# Altium project picr22-valdis.PrjPcb
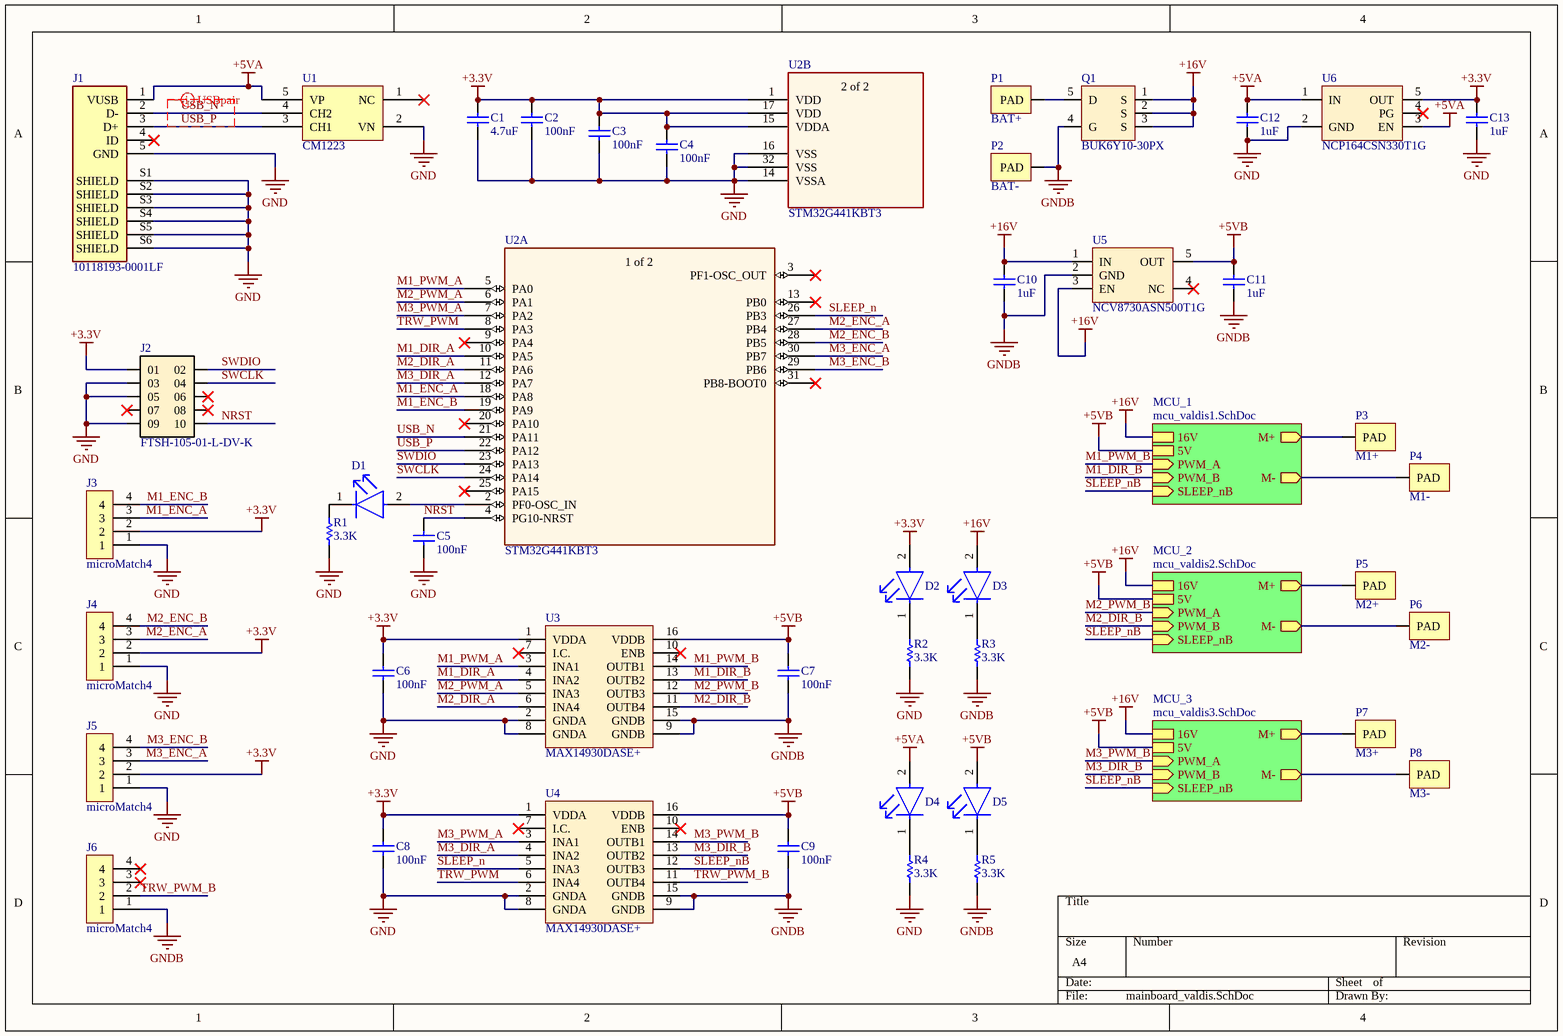
[diagram p0: mainboard_valdis.SchDoc]
4 sheets, 86 parts. Net scope: hierarchical (ports join the sheet entries above them; power ports are global).
Board file: PCB1.PcbDoc
Sheets:
  mainboard_valdis.SchDoc
    MCU_1 = mcu_valdis1.SchDoc
    MCU_2 = mcu_valdis2.SchDoc
    MCU_3 = mcu_valdis3.SchDoc

## Sheet mainboard_valdis.SchDoc
size A4; SheetNumber: 1; SheetTotal: 4

### Parts
C1  4.7uF  [CAPC1608X90X35ML10T15]
C2  100nF  [CAPC1608X90X35ML10T15]
C3  100nF  [CAPC1608X90X35ML10T15]
C4  100nF  [CAPC1608X90X35ML10T15]
C5  100nF  [CAPC1608X90X35ML10T15]
C6  100nF  [CAPC1608X90X35ML10T15]
C7  100nF  [CAPC1608X90X35ML10T15]
C8  100nF  [CAPC1608X90X35ML10T15]
C9  100nF  [CAPC1608X90X35ML10T15]
C10  1uF  [CAPC1608X90X35ML10T15]
C11  1uF  [CAPC1608X90X35ML10T15]
C12  1uF  [CAPC1608X90X35ML10T15]
C13  1uF  [CAPC1608X90X35ML10T15]
D1  LTST-C191TBKT  [FP-LTST-C191TBKT-MFG]  (value not drawn)
D2  LTST-C191TBKT  [FP-LTST-C191TBKT-MFG]  (value not drawn)
D3  LTST-C191TBKT  [FP-LTST-C191TBKT-MFG]  (value not drawn)
D4  LTST-C191TBKT  [FP-LTST-C191TBKT-MFG]  (value not drawn)
D5  LTST-C191TBKT  [FP-LTST-C191TBKT-MFG]  (value not drawn)
J1  10118193-0001LF  [FCI_10118193-0001LF]
J2  FTSH-105-01-L-DV-K  [FTSH-105-01-XXX-DV-K]
J3  microMatch4  [microMatch4]
J4  microMatch4  [microMatch4]
J5  microMatch4  [microMatch4]
J6  microMatch4  [microMatch4]
P1  BAT+  [PCBComponent_1]
P2  BAT-  [PCBComponent_1]
P3  M1+  [PCBComponent_1]
P4  M1-  [PCBComponent_1]
P5  M2+  [PCBComponent_1]
P6  M2-  [PCBComponent_1]
P7  M3+  [PCBComponent_1]
P8  M3-  [PCBComponent_1]
Q1  BUK6Y10-30PX  [TO127P600X120-5N]
R1  3.3K  [RESC1609X50X30NL8T20]
R2  3.3K  [RESC1609X50X30NL8T20]
R3  3.3K  [RESC1609X50X30NL8T20]
R4  3.3K  [RESC1609X50X30NL8T20]
R5  3.3K  [RESC1609X50X30NL8T20]
U1  CM1223  [SOT23-5]
U2  STM32G441KBT3  [LQFP32_7X7_STM]  (parts A,B of 2)
U3  MAX14930DASE+  [21-0041_S16+1_MXM]
U4  MAX14930DASE+  [21-0041_S16+1_MXM]
U5  NCV8730ASN500T1G  [TSSOP5]
U6  NCP164CSN330T1G  [SOP95P275X110-5N]

### Sub-sheets
MCU_1 = mcu_valdis1.SchDoc: 16V, 5V, PWM_A (in), M+ (out), M- (out), PWM_B (in), SLEEP_nB (in)
MCU_2 = mcu_valdis2.SchDoc: 16V, 5V, PWM_A (in), M+ (out), M- (out), PWM_B (in), SLEEP_nB (in)
MCU_3 = mcu_valdis3.SchDoc: 16V, 5V, PWM_A (in), M+ (out), M- (out), PWM_B (in), SLEEP_nB (in)

### Nets
+3.3V: C1.2 C2.2 C3.2 C4.2 C6.2 C8.2 C13.2 D2.2(A) J2.1(01) J3.2 J4.2 J5.2 U2.1(VDD) U2.15(VDDA) U2.17(VDD) U3.1(VDDA) U4.1(VDDA) U6.5(OUT)
+5VA: C12.2 D4.2(A) J1.1(VUSB) U1.5(VP) U6.1(IN) U6.3(EN)
+5VB: C7.2 C9.2 C11.2 D5.2(A) U3.16(VDDB) U4.16(VDDB) U5.5(OUT) ; sheet MCU_1/5V, sheet MCU_2/5V, sheet MCU_3/5V  [project net +5]
+16V: C10.2 D3.2(A) Q1.1(S) Q1.2(S) Q1.3(S) U5.1(IN) U5.3(EN) ; sheet MCU_1/16V, sheet MCU_2/16V, sheet MCU_3/16V
GND: C1.1 C2.1 C3.1 C4.1 C5.1 C6.1 C8.1 C12.1 C13.1 J1.5(GND) J1.S1(SHIELD) J1.S2(SHIELD) J1.S3(SHIELD) J1.S4(SHIELD) J1.S5(SHIELD) J1.S6(SHIELD) J2.3(03) J2.5(05) J2.9(09) J3.1 J4.1 J5.1 R1.1 R2.1 R4.1 U1.2(VN) U2.14(VSSA) U2.16(VSS) U2.32(VSS) U3.2(GNDA) U3.8(GNDA) U4.2(GNDA) U4.8(GNDA) U6.2(GND)
GNDB: C7.1 C9.1 C10.1 C11.1 J6.1 P2.1(PAD) Q1.4(G) R3.1 R5.1 U3.9(GNDB) U3.15(GNDB) U4.9(GNDB) U4.15(GNDB) U5.2(GND)
M1_DIR_A: U2.10(PA5) U3.4(INA2)
M1_DIR_B: U3.13(OUTB2) ; sheet MCU_1/PWM_B
M1_ENC_A: J3.3 U2.18(PA8)
M1_ENC_B: J3.4 U2.19(PA9)
M1_PWM_A: U2.5(PA0) U3.3(INA1)
M1_PWM_B: U3.14(OUTB1) ; sheet MCU_1/PWM_A
M2_DIR_A: U2.11(PA6) U3.6(INA4)
M2_DIR_B: U3.11(OUTB4) ; sheet MCU_2/PWM_B
M2_ENC_A: J4.3 U2.27(PB4)
M2_ENC_B: J4.4 U2.28(PB5)
M2_PWM_A: U2.6(PA1) U3.5(INA3)
M2_PWM_B: U3.12(OUTB3) ; sheet MCU_2/PWM_A
M3_DIR_A: U2.12(PA7) U4.4(INA2)
M3_DIR_B: U4.13(OUTB2) ; sheet MCU_3/PWM_B
M3_ENC_A: J5.3 U2.30(PB7)
M3_ENC_B: J5.4 U2.29(PB6)
M3_PWM_A: U2.7(PA2) U4.3(INA1)
M3_PWM_B: U4.14(OUTB1) ; sheet MCU_3/PWM_A
NRST: C5.2 J2.10 U2.4(PG10-NRST)
SLEEP_n: U2.26(PB3) U4.5(INA3)
SLEEP_nB: U4.12(OUTB3) ; sheet MCU_1/SLEEP_nB, sheet MCU_2/SLEEP_nB, sheet MCU_3/SLEEP_nB
SWCLK: J2.4(04) U2.24(PA14)
SWDIO: J2.2(02) U2.23(PA13)
TRW_PWM: U2.8(PA3) U4.6(INA4)
TRW_PWM_B: J6.2 U4.11(OUTB4)
USB_N: J1.2(D-) U1.4(CH2) U2.21(PA11)
USB_P: J1.3(D+) U1.3(CH1) U2.22(PA12)
NetD1_1: D1.1(C) R1.2
NetD1_2: D1.2(A) U2.2(PF0-OSC_IN)
NetD2_1: D2.1(C) R2.2
NetD3_1: D3.1(C) R3.2
NetD4_1: D4.1(C) R4.2
NetD5_1: D5.1(C) R5.2
NetP1_1: P1.1(PAD) Q1.5(D)
NetP3_1: P3.1(PAD) ; sheet MCU_1/M+
NetP4_1: P4.1(PAD) ; sheet MCU_1/M-
NetP5_1: P5.1(PAD) ; sheet MCU_2/M+
NetP6_1: P6.1(PAD) ; sheet MCU_2/M-
NetP7_1: P7.1(PAD) ; sheet MCU_3/M+
NetP8_1: P8.1(PAD) ; sheet MCU_3/M-

Not connected (* = marked no-connect by the designer): J1 4(ID)*; J2 6(06)* 7(07)* 8(08)*; J6 3* 4*; U1 1(NC)*; U2 3(PF1-OSC_OUT)* 9(PA4)* 13(PB0)* 20(PA10)* 25(PA15)* 31(PB8-BOOT0)*; U3 7(I.C.)* 10(ENB)*; U4 7(I.C.)* 10(ENB)*; U5 4(NC)*; U6 4(PG)*

### Layout directives
differential pair; rule Differential Pairs Routing [Pref Gap = 8mil    Min Gap  = 8mil    Max Gap  = 8milPref Width = 10.28mil    Min Width  = 10.28mil    Max Width  = 10.28mil]; differential pair class USBA: USB_N, USB_P

### Notes on the sheet
- (in symbol STM32G441KBT3, part A) 1 of 2
- (in symbol STM32G441KBT3, part B) 2 of 2

### Library data of the parts
C1-C13 = CMP-2000-04945-1: Chip Capacitor, 22 pF, +/- 5%, 50 V, -55 to 125 degC, 0603 (1608 Metric), RoHS, Tape and Reel; Manufacturer: Murata; Capacitance: 22pF; Rated Voltage: 50V; Dielectric: C0G; Manufacturer URL: http://www.murata.com/; Datasheet Version: Jul-06; Package Reference: 603; Tolerance (%): ±5%; Case Size/Dimension: 0603; Package Description: 2-Pin Surface Mount Device, Body 1.6 x 0.8 mm; Datasheet URL: https://datasheet.ciiva.com/11786/0900766b807a1cab-11786398.pdf
D1-D5 = CMP-22017-000008-1: LED BLUE CLEAR CHIP SMD; Lens Color: Colorless; Dominant Wavelength: 475nm; Forward Current: 20mA; Wavelength: 468nm; Viewing Angle: 130°; Power Dissipation: 76mW; Luminous Intensity: 180mcd; Reverse Voltage: 5V; Number of Elements: 1; Lens Style: Diffused; Forward Voltage: 3.8V; Max Power Dissipation: 75mW; Case Code (Metric): 1608; Packaging: Tape and Reel; Case/Package: 0603; Depth: 1.6mm; Mount: Surface Mount; Lead Free: Lead Free; Min Operating Temperature: -20°C; Lens Transparency: Clear; Illumination Color: Blue; Height: 0.55mm; Test Current: 20mA; Case Code (Imperial): 0603; Max Operating Temperature: 80°C; Number of Pins: 2; Length: 0.8mm; Radiation Hardening: No; Package Quantity: 1; Number of LEDs: 1; Width: 0.8mm; Color: Blue
J1 = 10118193-0001LF: USB - micro B USB 2.0 Receptacle Connector 5 Position Surface Mount, Right Angle; Through Hole; MF: Amphenol ICC; Availability: Unavailable; SnapEDA_Link: https://www.snapeda.com/parts/10118193-0001LF/Amphenol%20FCI/view-part/2758989/?ref=snap; MP: 10118193-0001LF; Price: None; Value: *; Package: None
P1-P8 = Pad4x4
R1-R5 = CMP-2000-03816-5: Chip Resistor, 0 Ohm, Jumper, 100 mW, -55 to 155 degC, 0603 (1608 Metric), RoHS, Tape and Reel; Manufacturer: Vishay Semiconductor; Voltage Rating: 75 V; Package Quantity: 5000; DatasheetVersion: 06/2012; Min Operating Temperature: -55 degC; ComponentLink1URL: http://www.vishay.com/; Mounting Technology: Surface Mount; Height: 0.45 mm; ComponentLink1Description: Manufacturer URL; REACH SVHC: Unknown; PackageReference: 0603; Packaging: Tape and Reel; Max Operating Temperature: 155 degC; Mount: Surface Mount; ComponentLink2Description: Datasheet; PackageDescription: 2-Pin Surface Mount Device, Body 1.575 x 0.85 mm; Length: 1.55 mm; ComponentLink2URL: http://www.vishay.com/docs/20035/dcrcwe3.pdf; Pins: 2; RoHSCompliant: true
U2 = STM32G441KBT3: No Description Available; SourceLibrary: Add_to_database_2020-11-05; Built_By: EMA_Cory; Vendor: STMicroelectronics; Datasheet: https://www.st.com/resource/en/datasheet/stm32g441kb.pdf; Copyright: Copyright (C) 2018 Accelerated Designs. All rights reserved; Manufacturer_Part_Number: STM32G441KBT3; RefDes: RefDes; Type: DEV

## Sheet mcu_valdis1.SchDoc
size A4; SheetNumber: 2; SheetTotal: 4
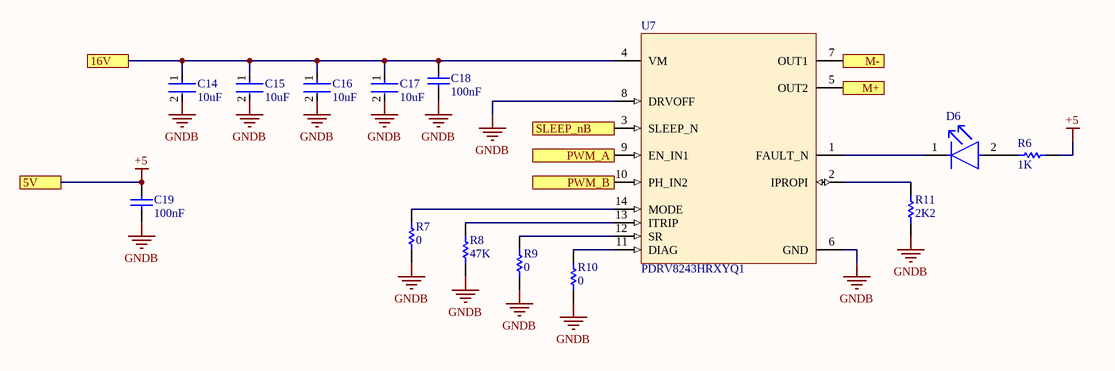
[diagram p1: mcu_valdis1.SchDoc]

### Parts
C14  10uF  [FP-CL21-IPC_C]
C15  10uF  [FP-CL21-IPC_C]
C16  10uF  [FP-CL21-IPC_C]
C17  10uF  [FP-CL21-IPC_C]
C18  100nF  [CAPC1608X90X35ML10T15]
C19  100nF  [CAPC1608X90X35ML10T15]
D6  LTST-C191TBKT  [FP-LTST-C191TBKT-MFG]  (value not drawn)
R6  1K  [RESC1609X50X30NL8T20]
R7  0  [RESC1609X50X30NL8T20]
R8  47K  [RESC1609X50X30NL8T20]
R9  0  [RESC1609X50X30NL8T20]
R10  0  [RESC1609X50X30NL8T20]
R11  2K2  [RESC1609X50X30NL8T20]
U7  PDRV8243HRXYQ1  [RXY0014A-MFG]

### Ports
5V (see mainboard_valdis[3B], mcu_valdis2[1B], mcu_valdis3[1B]), 16V (see mainboard_valdis[3B], mcu_valdis2[1B], mcu_valdis3[1B]), M+ (out, see mainboard_valdis[4B]), M- (out, see mainboard_valdis[4B]), PWM_A (in, see mainboard_valdis[3B]), PWM_B (in, see mainboard_valdis[3B]), SLEEP_nB (in, see mainboard_valdis[3B], mcu_valdis2[2B], mcu_valdis3[2B])

### Nets
+5: C19.2 R6.2 ; port 5V
+16V: C14.1 C15.1 C16.1 C17.1 C18.2 U7.4(VM) ; port 16V
GNDB: C14.2 C15.2 C16.2 C17.2 C18.1 C19.1 R7.1 R8.1 R9.1 R10.1 R11.1 U7.6(GND) U7.8(DRVOFF)
M1_DIR_B: U7.10(PH_IN2) ; port PWM_B
M1_PWM_B: U7.9(EN_IN1) ; port PWM_A
SLEEP_nB: U7.3(SLEEP_N) ; port SLEEP_nB
NetD6_1: D6.1(C) U7.1(FAULT_N)
NetD6_2: D6.2(A) R6.1
NetP3_1: U7.5(OUT2) ; port M+
NetP4_1: U7.7(OUT1) ; port M-
NetR7_2: R7.2 U7.14(MODE)
NetR8_2: R8.2 U7.13(ITRIP)
NetR9_2: R9.2 U7.12(SR)
NetR10_2: R10.2 U7.11(DIAG)
NetR11_2: R11.2 U7.2(IPROPI)

### Library data of the parts
C14-C17 = CMP-13271-003225-1: CL21 Series 0805 22uF 25V ±20% Tolerance X5R Multilayer Ceramic Chip Capacitor
C18 C19 = CMP-2000-04945-1: as C1 on sheet mainboard_valdis; Manufacturer URL: http://www.murata.com/; Datasheet Version: Jul-06; Package Reference: 603; Tolerance (%): ±5%; Case Size/Dimension: 0603; Package Description: 2-Pin Surface Mount Device, Body 1.6 x 0.8 mm; Datasheet URL: https://datasheet.ciiva.com/11786/0900766b807a1cab-11786398.pdf
D6 = CMP-22017-000008-1: as D1 on sheet mainboard_valdis; Case Code (Metric): 1608; Packaging: Tape and Reel; Case/Package: 0603; Depth: 1.6mm; Mount: Surface Mount; Lead Free: Lead Free; Min Operating Temperature: -20°C; Lens Transparency: Clear; Illumination Color: Blue; Height: 0.55mm; Test Current: 20mA; Case Code (Imperial): 0603; Max Operating Temperature: 80°C; Number of Pins: 2; Length: 0.8mm; Radiation Hardening: No; Package Quantity: 1; Number of LEDs: 1; Width: 0.8mm; Color: Blue
R6-R11 = CMP-2000-03816-5: as R1 on sheet mainboard_valdis; Package Quantity: 5000; DatasheetVersion: 06/2012; Min Operating Temperature: -55 degC; ComponentLink1URL: http://www.vishay.com/; Mounting Technology: Surface Mount; Height: 0.45 mm; ComponentLink1Description: Manufacturer URL; REACH SVHC: Unknown; PackageReference: 0603; Packaging: Tape and Reel; Max Operating Temperature: 155 degC; Mount: Surface Mount; ComponentLink2Description: Datasheet; PackageDescription: 2-Pin Surface Mount Device, Body 1.575 x 0.85 mm; Length: 1.55 mm; ComponentLink2URL: http://www.vishay.com/docs/20035/dcrcwe3.pdf; Pins: 2; RoHSCompliant: true
U7 = PDRV8243HRXYQ1: No Description Available; Mfr_Name: Texas Instruments; Type: DEV; RefDes: RefDes; Copyright: Copyright (C) 2022 Ultra Librarian. All rights reserved.; Manufacturer_Part_Number: PDRV8243HRXYQ1

## Sheet mcu_valdis2.SchDoc
size A4; SheetNumber: 3; SheetTotal: 4
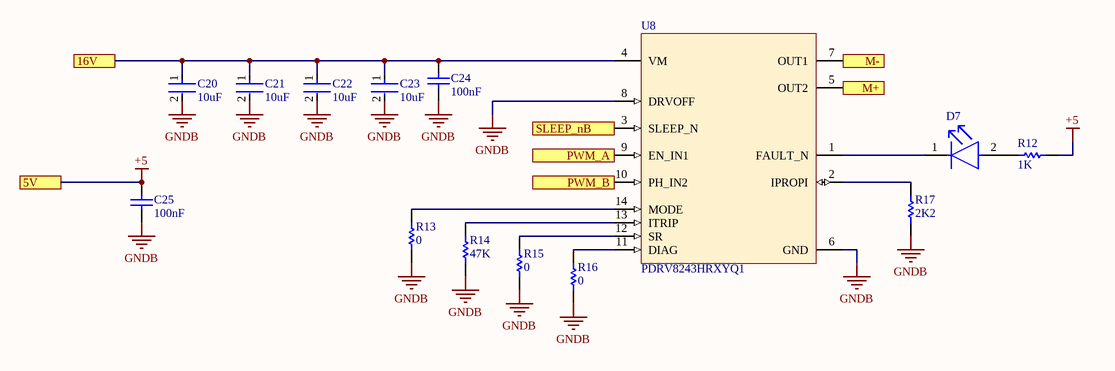
[diagram p2: mcu_valdis2.SchDoc]

### Parts
C20  10uF  [FP-CL21-IPC_C]
C21  10uF  [FP-CL21-IPC_C]
C22  10uF  [FP-CL21-IPC_C]
C23  10uF  [FP-CL21-IPC_C]
C24  100nF  [CAPC1608X90X35ML10T15]
C25  100nF  [CAPC1608X90X35ML10T15]
D7  LTST-C191TBKT  [FP-LTST-C191TBKT-MFG]  (value not drawn)
R12  1K  [RESC1609X50X30NL8T20]
R13  0  [RESC1609X50X30NL8T20]
R14  47K  [RESC1609X50X30NL8T20]
R15  0  [RESC1609X50X30NL8T20]
R16  0  [RESC1609X50X30NL8T20]
R17  2K2  [RESC1609X50X30NL8T20]
U8  PDRV8243HRXYQ1  [RXY0014A-MFG]

### Ports
5V (see mainboard_valdis[3C], mcu_valdis1[1B], mcu_valdis3[1B]), 16V (see mainboard_valdis[3C], mcu_valdis1[1B], mcu_valdis3[1B]), M+ (out, see mainboard_valdis[4C]), M- (out, see mainboard_valdis[4C]), PWM_A (in, see mainboard_valdis[3C]), PWM_B (in, see mainboard_valdis[3C]), SLEEP_nB (in, see mainboard_valdis[3C], mcu_valdis1[2B], mcu_valdis3[2B])

### Nets
+5: C25.2 R12.2 ; port 5V
+16V: C20.1 C21.1 C22.1 C23.1 C24.2 U8.4(VM) ; port 16V
GNDB: C20.2 C21.2 C22.2 C23.2 C24.1 C25.1 R13.1 R14.1 R15.1 R16.1 R17.1 U8.6(GND) U8.8(DRVOFF)
M2_DIR_B: U8.10(PH_IN2) ; port PWM_B
M2_PWM_B: U8.9(EN_IN1) ; port PWM_A
SLEEP_nB: U8.3(SLEEP_N) ; port SLEEP_nB
NetD7_1: D7.1(C) U8.1(FAULT_N)
NetD7_2: D7.2(A) R12.1
NetP5_1: U8.5(OUT2) ; port M+
NetP6_1: U8.7(OUT1) ; port M-
NetR13_2: R13.2 U8.14(MODE)
NetR14_2: R14.2 U8.13(ITRIP)
NetR15_2: R15.2 U8.12(SR)
NetR16_2: R16.2 U8.11(DIAG)
NetR17_2: R17.2 U8.2(IPROPI)

### Library data of the parts
C20-C23 = CMP-13271-003225-1: as C14 on sheet mcu_valdis1
C24 C25 = CMP-2000-04945-1: as C1 on sheet mainboard_valdis; Manufacturer URL: http://www.murata.com/; Datasheet Version: Jul-06; Package Reference: 603; Tolerance (%): ±5%; Case Size/Dimension: 0603; Package Description: 2-Pin Surface Mount Device, Body 1.6 x 0.8 mm; Datasheet URL: https://datasheet.ciiva.com/11786/0900766b807a1cab-11786398.pdf
D7 = CMP-22017-000008-1: as D1 on sheet mainboard_valdis; Case Code (Metric): 1608; Packaging: Tape and Reel; Case/Package: 0603; Depth: 1.6mm; Mount: Surface Mount; Lead Free: Lead Free; Min Operating Temperature: -20°C; Lens Transparency: Clear; Illumination Color: Blue; Height: 0.55mm; Test Current: 20mA; Case Code (Imperial): 0603; Max Operating Temperature: 80°C; Number of Pins: 2; Length: 0.8mm; Radiation Hardening: No; Package Quantity: 1; Number of LEDs: 1; Width: 0.8mm; Color: Blue
R12-R17 = CMP-2000-03816-5: as R1 on sheet mainboard_valdis; Package Quantity: 5000; DatasheetVersion: 06/2012; Min Operating Temperature: -55 degC; ComponentLink1URL: http://www.vishay.com/; Mounting Technology: Surface Mount; Height: 0.45 mm; ComponentLink1Description: Manufacturer URL; REACH SVHC: Unknown; PackageReference: 0603; Packaging: Tape and Reel; Max Operating Temperature: 155 degC; Mount: Surface Mount; ComponentLink2Description: Datasheet; PackageDescription: 2-Pin Surface Mount Device, Body 1.575 x 0.85 mm; Length: 1.55 mm; ComponentLink2URL: http://www.vishay.com/docs/20035/dcrcwe3.pdf; Pins: 2; RoHSCompliant: true
U8 = PDRV8243HRXYQ1: as U7 on sheet mcu_valdis1; Type: DEV; RefDes: RefDes; Copyright: Copyright (C) 2022 Ultra Librarian. All rights reserved.; Manufacturer_Part_Number: PDRV8243HRXYQ1

## Sheet mcu_valdis3.SchDoc
size A4; SheetNumber: 4; SheetTotal: 4
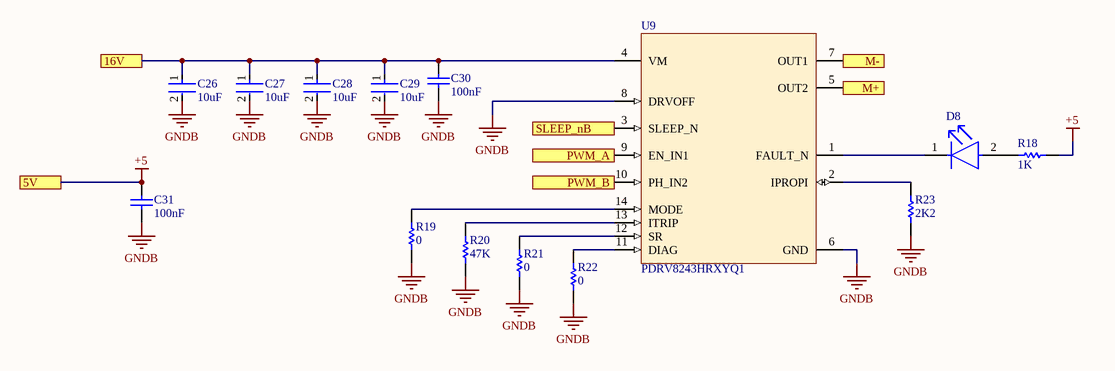
[diagram p3: mcu_valdis3.SchDoc]

### Parts
C26  10uF  [FP-CL21-IPC_C]
C27  10uF  [FP-CL21-IPC_C]
C28  10uF  [FP-CL21-IPC_C]
C29  10uF  [FP-CL21-IPC_C]
C30  100nF  [CAPC1608X90X35ML10T15]
C31  100nF  [CAPC1608X90X35ML10T15]
D8  LTST-C191TBKT  [FP-LTST-C191TBKT-MFG]  (value not drawn)
R18  1K  [RESC1609X50X30NL8T20]
R19  0  [RESC1609X50X30NL8T20]
R20  47K  [RESC1609X50X30NL8T20]
R21  0  [RESC1609X50X30NL8T20]
R22  0  [RESC1609X50X30NL8T20]
R23  2K2  [RESC1609X50X30NL8T20]
U9  PDRV8243HRXYQ1  [RXY0014A-MFG]

### Ports
5V (see mainboard_valdis[3C], mcu_valdis1[1B], mcu_valdis2[1B]), 16V (see mainboard_valdis[3C], mcu_valdis1[1B], mcu_valdis2[1B]), M+ (out, see mainboard_valdis[4C]), M- (out, see mainboard_valdis[4D]), PWM_A (in, see mainboard_valdis[3C]), PWM_B (in, see mainboard_valdis[3D]), SLEEP_nB (in, see mainboard_valdis[3D], mcu_valdis1[2B], mcu_valdis2[2B])

### Nets
+5: C31.2 R18.2 ; port 5V
+16V: C26.1 C27.1 C28.1 C29.1 C30.2 U9.4(VM) ; port 16V
GNDB: C26.2 C27.2 C28.2 C29.2 C30.1 C31.1 R19.1 R20.1 R21.1 R22.1 R23.1 U9.6(GND) U9.8(DRVOFF)
M3_DIR_B: U9.10(PH_IN2) ; port PWM_B
M3_PWM_B: U9.9(EN_IN1) ; port PWM_A
SLEEP_nB: U9.3(SLEEP_N) ; port SLEEP_nB
NetD8_1: D8.1(C) U9.1(FAULT_N)
NetD8_2: D8.2(A) R18.1
NetP7_1: U9.5(OUT2) ; port M+
NetP8_1: U9.7(OUT1) ; port M-
NetR19_2: R19.2 U9.14(MODE)
NetR20_2: R20.2 U9.13(ITRIP)
NetR21_2: R21.2 U9.12(SR)
NetR22_2: R22.2 U9.11(DIAG)
NetR23_2: R23.2 U9.2(IPROPI)

### Library data of the parts
C26-C29 = CMP-13271-003225-1: as C14 on sheet mcu_valdis1
C30 C31 = CMP-2000-04945-1: as C1 on sheet mainboard_valdis; Manufacturer URL: http://www.murata.com/; Datasheet Version: Jul-06; Package Reference: 603; Tolerance (%): ±5%; Case Size/Dimension: 0603; Package Description: 2-Pin Surface Mount Device, Body 1.6 x 0.8 mm; Datasheet URL: https://datasheet.ciiva.com/11786/0900766b807a1cab-11786398.pdf
D8 = CMP-22017-000008-1: as D1 on sheet mainboard_valdis; Case Code (Metric): 1608; Packaging: Tape and Reel; Case/Package: 0603; Depth: 1.6mm; Mount: Surface Mount; Lead Free: Lead Free; Min Operating Temperature: -20°C; Lens Transparency: Clear; Illumination Color: Blue; Height: 0.55mm; Test Current: 20mA; Case Code (Imperial): 0603; Max Operating Temperature: 80°C; Number of Pins: 2; Length: 0.8mm; Radiation Hardening: No; Package Quantity: 1; Number of LEDs: 1; Width: 0.8mm; Color: Blue
R18-R23 = CMP-2000-03816-5: as R1 on sheet mainboard_valdis; Package Quantity: 5000; DatasheetVersion: 06/2012; Min Operating Temperature: -55 degC; ComponentLink1URL: http://www.vishay.com/; Mounting Technology: Surface Mount; Height: 0.45 mm; ComponentLink1Description: Manufacturer URL; REACH SVHC: Unknown; PackageReference: 0603; Packaging: Tape and Reel; Max Operating Temperature: 155 degC; Mount: Surface Mount; ComponentLink2Description: Datasheet; PackageDescription: 2-Pin Surface Mount Device, Body 1.575 x 0.85 mm; Length: 1.55 mm; ComponentLink2URL: http://www.vishay.com/docs/20035/dcrcwe3.pdf; Pins: 2; RoHSCompliant: true
U9 = PDRV8243HRXYQ1: as U7 on sheet mcu_valdis1; Type: DEV; RefDes: RefDes; Copyright: Copyright (C) 2022 Ultra Librarian. All rights reserved.; Manufacturer_Part_Number: PDRV8243HRXYQ1

## Nets that join several sheets
+5: mainboard_valdis (7 pins), mcu_valdis1 (C19.2 R6.2), mcu_valdis2 (C25.2 R12.2), mcu_valdis3 (C31.2 R18.2)
+16V: mainboard_valdis (7 pins), mcu_valdis1 (6 pins), mcu_valdis2 (6 pins), mcu_valdis3 (6 pins)
GNDB: mainboard_valdis (14 pins), mcu_valdis1 (13 pins), mcu_valdis2 (13 pins), mcu_valdis3 (13 pins)
M1_DIR_B: mainboard_valdis (U3.13), mcu_valdis1 (U7.10)
M1_PWM_B: mainboard_valdis (U3.14), mcu_valdis1 (U7.9)
M2_DIR_B: mainboard_valdis (U3.11), mcu_valdis2 (U8.10)
M2_PWM_B: mainboard_valdis (U3.12), mcu_valdis2 (U8.9)
M3_DIR_B: mainboard_valdis (U4.13), mcu_valdis3 (U9.10)
M3_PWM_B: mainboard_valdis (U4.14), mcu_valdis3 (U9.9)
NetP3_1: mainboard_valdis (P3.1), mcu_valdis1 (U7.5)
NetP4_1: mainboard_valdis (P4.1), mcu_valdis1 (U7.7)
NetP5_1: mainboard_valdis (P5.1), mcu_valdis2 (U8.5)
NetP6_1: mainboard_valdis (P6.1), mcu_valdis2 (U8.7)
NetP7_1: mainboard_valdis (P7.1), mcu_valdis3 (U9.5)
NetP8_1: mainboard_valdis (P8.1), mcu_valdis3 (U9.7)
SLEEP_nB: mainboard_valdis (U4.12), mcu_valdis1 (U7.3), mcu_valdis2 (U8.3), mcu_valdis3 (U9.3)